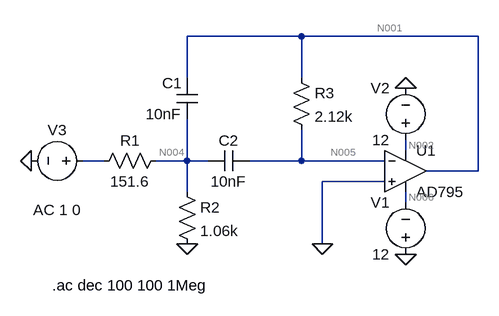
[diagram p0: schematic task4.asc]
task4.asc, the LTspice schematic file:
Version 4.1
SHEET 1 880 680
WIRE 48 -32 -128 -32
WIRE 320 -32 48 -32
WIRE -128 32 -128 -32
WIRE 48 32 48 -32
WIRE 208 144 208 128
WIRE -256 160 -288 160
WIRE -128 160 -128 96
WIRE -128 160 -176 160
WIRE -96 160 -128 160
WIRE 48 160 48 112
WIRE 48 160 -32 160
WIRE 176 160 48 160
WIRE 320 176 320 -32
WIRE 320 176 240 176
WIRE 176 192 80 192
WIRE -128 208 -128 160
WIRE 208 224 208 208
WIRE 80 288 80 192
FLAG 208 304 0
FLAG 208 48 0
FLAG -128 288 0
FLAG 80 288 0
FLAG -368 160 0
SYMBOL OpAmps\\AD795 208 112 R0
SYMATTR InstName U1
SYMBOL voltage 208 320 R180
WINDOW 0 24 96 Left 2
WINDOW 3 24 16 Left 2
SYMATTR InstName V1
SYMATTR Value 12
SYMBOL voltage 208 144 R180
WINDOW 0 24 96 Left 2
WINDOW 3 24 16 Left 2
SYMATTR InstName V2
SYMATTR Value 12
SYMBOL cap -112 96 R180
WINDOW 0 24 56 Left 2
WINDOW 3 24 8 Left 2
SYMATTR InstName C1
SYMATTR Value 10nF
SYMBOL cap -32 144 R90
WINDOW 0 0 32 VBottom 2
WINDOW 3 32 32 VTop 2
SYMATTR InstName C2
SYMATTR Value 10nF
SYMBOL res -160 144 R90
WINDOW 0 0 56 VBottom 2
WINDOW 3 32 56 VTop 2
SYMATTR InstName R1
SYMATTR Value 151.6
SYMBOL res -144 192 R0
SYMATTR InstName R2
SYMATTR Value 1.06k
SYMBOL res 32 16 R0
SYMATTR InstName R3
SYMATTR Value 2.12k
SYMBOL voltage -272 160 R90
WINDOW 0 -32 56 VBottom 2
WINDOW 3 32 56 VTop 2
WINDOW 123 60 56 VTop 2
WINDOW 39 0 0 Left 0
SYMATTR InstName V3
SYMATTR Value ""
SYMATTR Value2 AC 1 0
TEXT -336 352 Left 2 !.ac dec 100 100 1Meg

The netlist it stands for:
* task4.asc
X§U1 0 N005 N002 N006 N001 AD795  ; pins In+ In- V+ V- OUT
V1 0 N006 12
V2 N002 0 12
C1 N004 N001 10nF
C2 N005 N004 10nF
R1 N004 N003 151.6
R2 N004 0 1.06k
R3 N001 N005 2.12k
V3 N003 0 AC 1 0
.ac dec 100 100 1Meg
.lib ADI1.lib
.backanno
.end

* Results of the author's LTspice run, read from the files saved beside the schematic
* Operating Point, zero values left out:
*   V(n002) = 12 V
*   V(n006) = -12 V
*   I(V1) = -1.226 mA
*   I(V2) = -1.226 mA
*   Ix(u1:3) = 1.226 mA
*   Ix(u1:4) = -1.226 mA
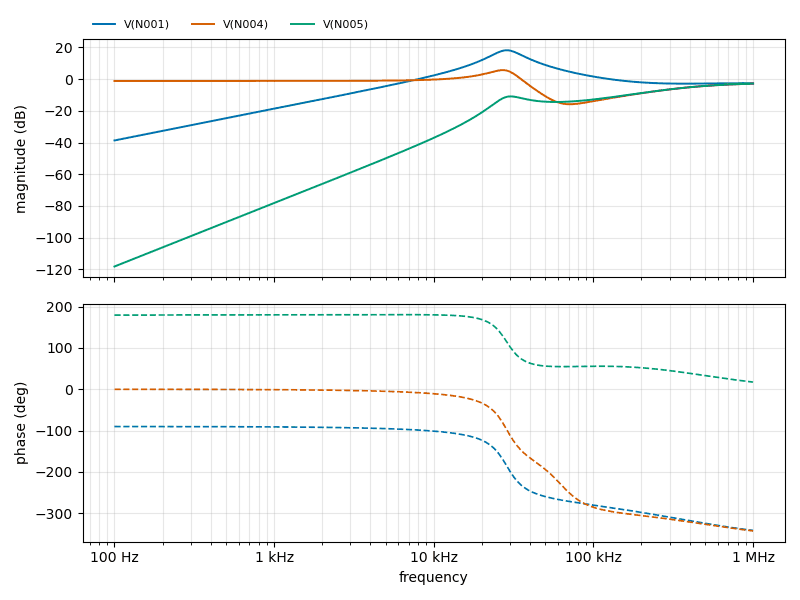
[diagram p1: AC Analysis of task4.asc, plotted from the saved traces]
* AC Analysis, 1 run:
*   V(N001): -38.67 dB at 100 Hz, -2.48 dB at 1 MHz, peak 18.23 dB at 28.84 kHz, 3 dB below the peak at 23.34 kHz and 35.29 kHz
*   V(N004): -1.16 dB at 100 Hz, -2.85 dB at 1 MHz, peak 5.71 dB at 26.92 kHz, 3 dB below the peak at 19.49 kHz and 32.41 kHz
*   V(N005): -118.22 dB at 100 Hz, -2.85 dB at 1 MHz, peak -2.85 dB at 1 MHz, 3 dB below the peak at 337.5 kHz